# Altium project Temp_hum_sensor_Atmega328.PrjPcb
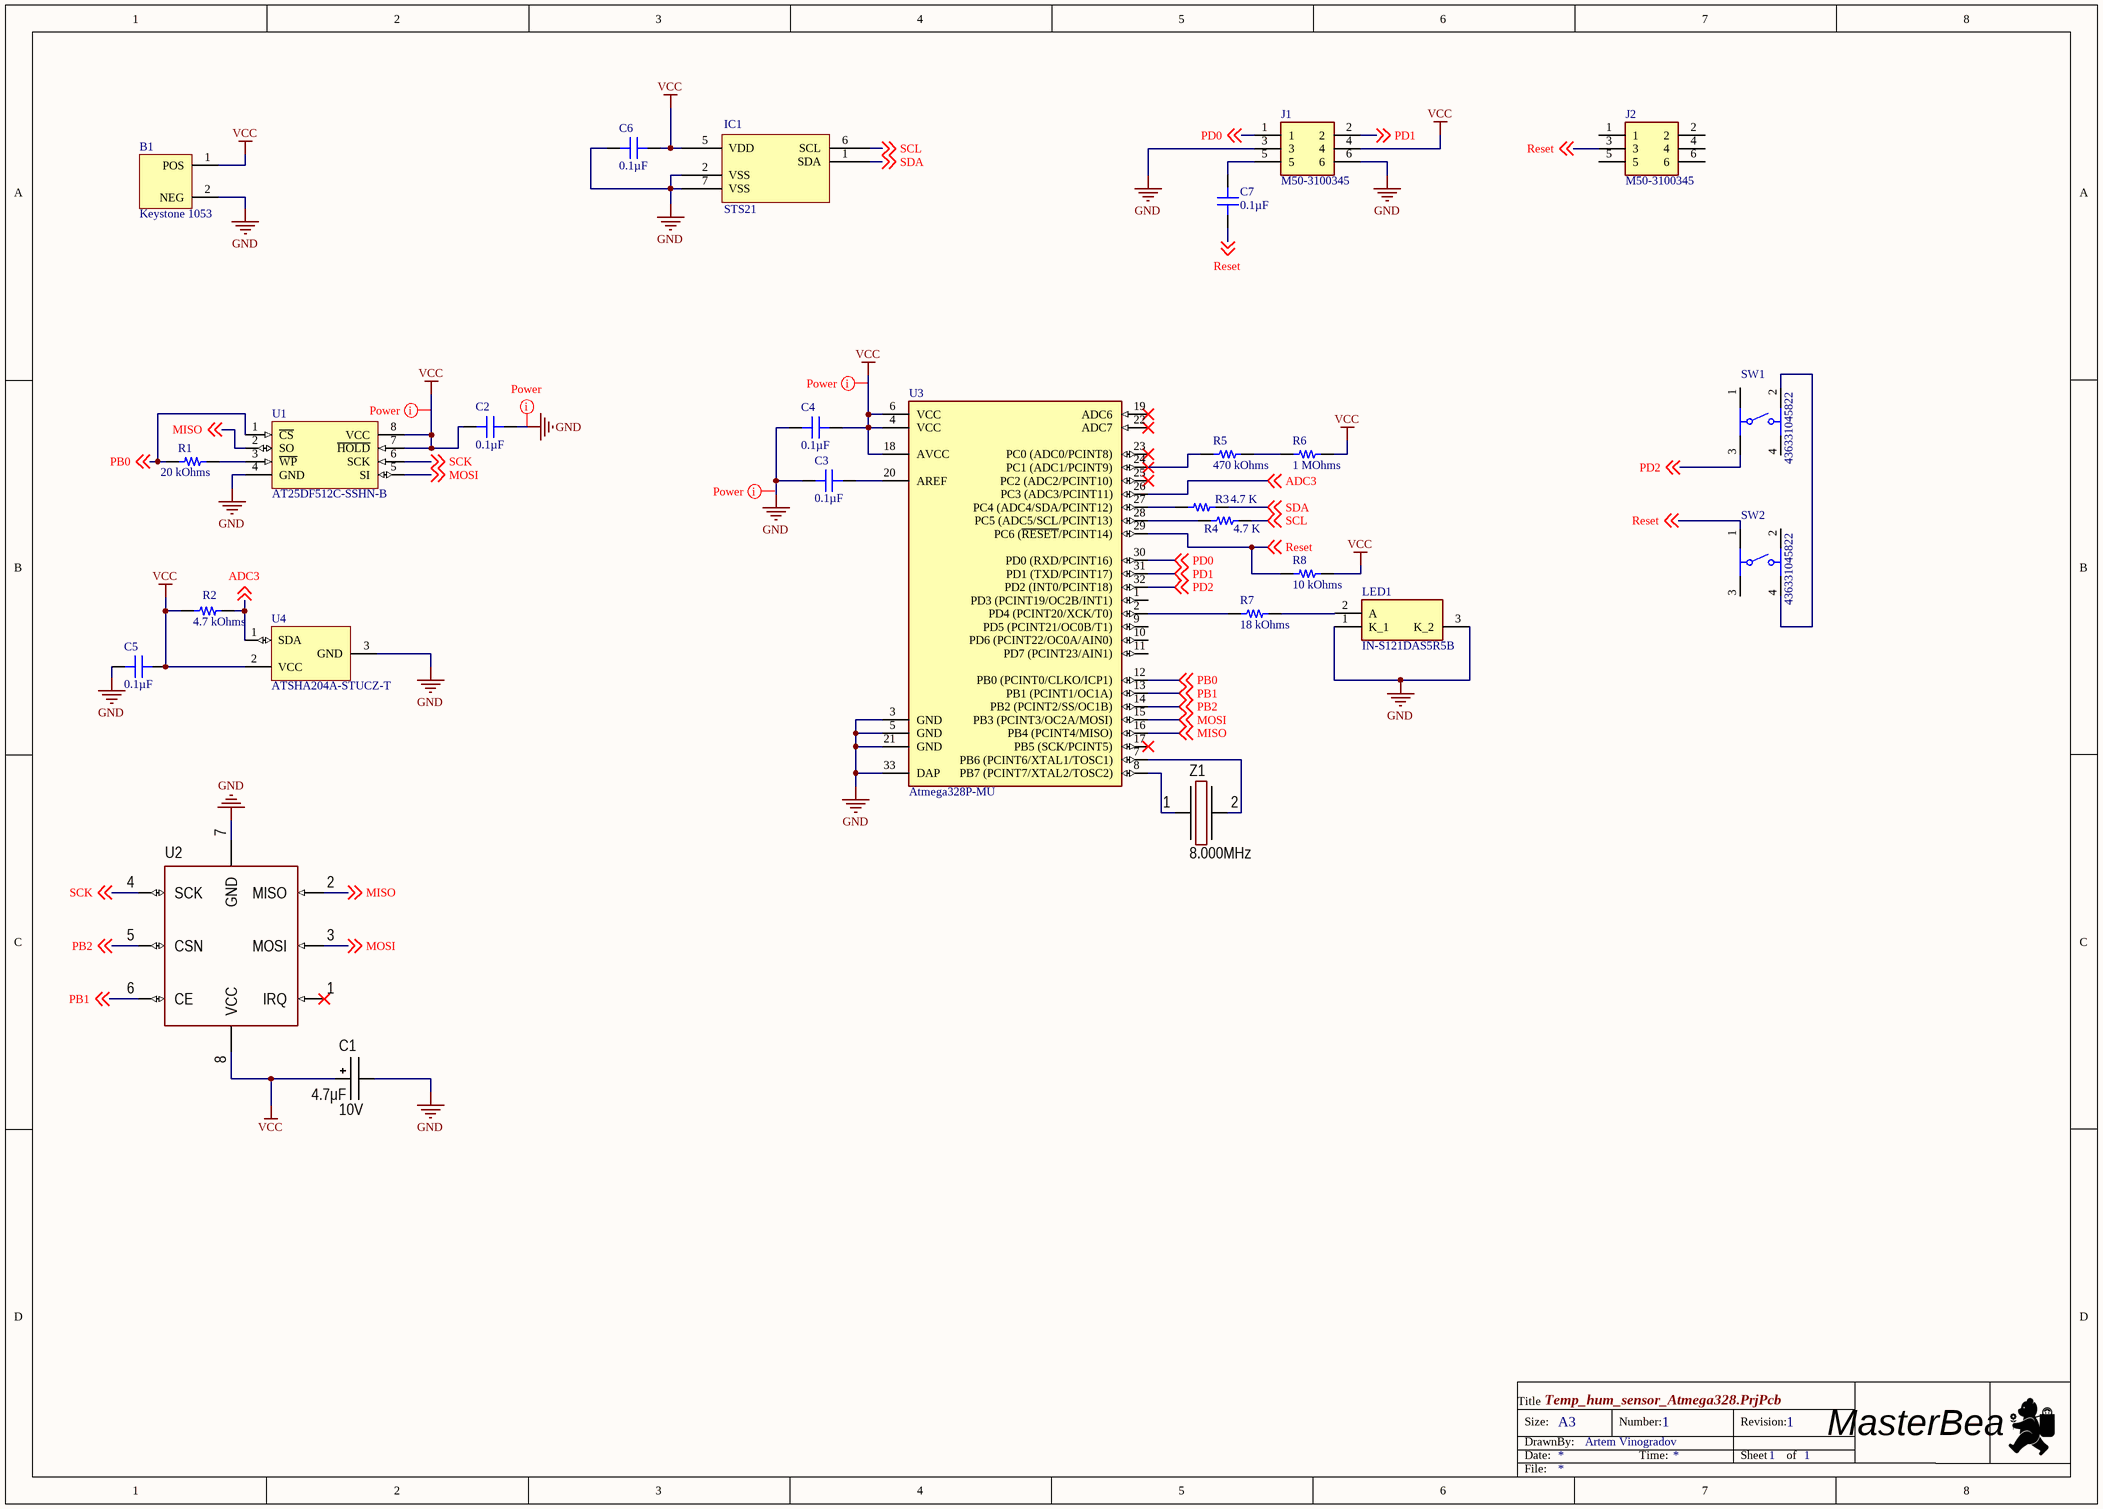
[diagram p0: Temp_hum_sensor_Atmega328.SchDoc]
Title: =title
1 sheet, 27 parts. Net scope: global (net labels, ports and power ports of the same name join across sheets).
Board file: Temp_hum_sensor_Atmega328.PcbDoc

## Sheet Temp_hum_sensor_Atmega328.SchDoc: =title
size A3; CompanyName: MasterBear; DrawnBy: Artem Vinogradov; DocumentNumber: 1; Revision: 1; SheetNumber: 1; SheetTotal: 1

### Parts
B1  Keystone 1053  [KEYSTONE 1053]
C1  value 4.7μF  Voltage: 10V  [CAP: TANTAL-A]
C2  0.1µF  [CAP 0805_2012]
C3  0.1µF  [CAP 0805_2012]
C4  0.1µF  [CAP 0805_2012]
C5  0.1µF  [CAP 0805_2012]
C6  0.1µF  [CAP 0805_2012]
C7  0.1µF  [CAP 0805_2012]
IC1  STS21  [SENSIRION STS21]
J1  M50-3100345  [M503100345]
J2  M50-3100345  [M503100345]
LED1  IN-S121DAS5R5B  [INS126ASUW]
R1  20 kOhms  [RES 0805_2012]
R2  4.7 kOhms  [RES 0805_2012]
R3  4.7 K  [RES 0805_2012]
R4  4.7 K  [RES 0805_2012]
R5  470 kOhms  [RES 0805_2012]
R6  1 MOhms  [RES 0805_2012]
R7  18 kOhms  [RES 0805_2012]
R8  10 kOhms  [RES 0805_2012]
SW1  436331045822  [4363x10458xx]
SW2  436331045822  [4363x10458xx]
U1  AT25DF512C-SSHN-B  [SOIC127P600X175-8N]
U2  (no value)  [MOD: NRF24 Mini SMD]
U3  Atmega328P-MU  [QFN-32 (5X5)]
U4  ATSHA204A-STUCZ-T  [SOT23-3]
Z1  Frequency: 8.000MHz  [OSC: 3215]

### Nets
GND: B1.2(NEG) C1.2 C2.2 C3.1 C4.1 C5.1 C6.1 IC1.2(VSS) IC1.7(VSS) J1.3 J1.6 LED1.1(K_1) LED1.3(K_2) U1.4(GND) U2.7(GND) U3.3(GND) U3.5(GND) U3.21(GND) U3.33(DAP) U4.3(GND)
VCC: B1.1(POS) C1.1 C2.1 C4.2 C5.2 C6.2 IC1.5(VDD) J1.4 R2.1 R6.2 R8.2 U1.7(~{HOLD}) U1.8(VCC) U2.8(VCC) U3.4(VCC) U3.6(VCC) U3.18(AVCC) U4.2(VCC)
ADC3: R2.2 U3.26(PC3_(ADC3/PCINT11)) U4.1(SDA) ; off-sheet ADC3
MISO: U1.2(SO) U2.2(MISO) U3.16(PB4_(PCINT4/MISO)) ; off-sheet MISO
MOSI: U1.5(SI) U2.3(MOSI) U3.15(PB3_(PCINT3/OC2A/MOSI)) ; off-sheet MOSI
PB0: R1.1 U1.1(~{CS}) U3.12(PB0_(PCINT0/CLKO/ICP1)) ; off-sheet PB0
PB1: U2.6(CE) U3.13(PB1_(PCINT1/OC1A)) ; off-sheet PB1
PB2: U2.5(CSN) U3.14(PB2_(PCINT2/SS/OC1B)) ; off-sheet PB2
PD0: J1.1 U3.30(PD0_(RXD/PCINT16)) ; off-sheet PD0
PD1: J1.2 U3.31(PD1_(TXD/PCINT17)) ; off-sheet PD1
PD2: SW1.3 U3.32(PD2_(INT0/PCINT18)) ; off-sheet PD2
Reset: C7.1 J2.3 R8.1 SW2.1 U3.29(PC6_(~{RESET}/PCINT14)) ; off-sheet Reset
SCK: U1.6(SCK) U2.4(SCK) ; off-sheet SCK
SCL: IC1.6(SCL) R4.2 ; off-sheet SCL
SDA: IC1.1(SDA) R3.2 ; off-sheet SDA
NetC3_2: C3.2 U3.20(AREF)
NetC7_2: C7.2 J1.5
NetLED1_2: LED1.2(A) R7.2
NetR1_2: R1.2 U1.3(~{WP})
NetR3_1: R3.1 U3.27(PC4_(ADC4/SDA/PCINT12))
NetR4_1: R4.1 U3.28(PC5_(ADC5/SCL/PCINT13))
NetR5_1: R5.1 U3.24(PC1_(ADC1/PCINT9))
NetR5_2: R5.2 R6.1
NetR7_1: R7.1 U3.2(PD4_(PCINT20/XCK/T0))
NetSW1_2: SW1.2 SW2.4
NetU3_7: U3.7(PB6_(PCINT6/XTAL1/TOSC1)) Z1.2
NetU3_8: U3.8(PB7_(PCINT7/XTAL2/TOSC2)) Z1.1

Not connected (* = marked no-connect by the designer): J2 1 2 4 5 6; SW1 1 4; SW2 2 3; U2 1(IRQ)*; U3 1(PD3_(PCINT19/OC2B/INT1)) 9(PD5_(PCINT21/OC0B/T1)) 10(PD6_(PCINT22/OC0A/AIN0)) 11(PD7_(PCINT23/AIN1)) 17(PB5_(SCK/PCINT5))* 19(ADC6)* 22(ADC7)* 23(PC0_(ADC0/PCINT8))* 25(PC2_(ADC2/PCINT10))*

### Layout directives
net class Power: (no net found under the mark), GND, VCC

### Notes on the sheet
- Title
- Size:
- Date:
- DrawnBy:
- A3
- Number:
- Time:
- Revision:
- Sheet
- of
- File:

### Library data of the parts
C1 = Tantal_A: Manufacturer: AVX; PartNumber: F930J107KAAAJ6; ValueManufacturerPartNumber: Tantalum capacitor, 4.7μF, 10V, ±10%, 2Ohm, case A (3216), -55...+125°C; Impedance: 2Ohm; Tolerance: ±10%; TypeDielectric: X7R; TypeCapacitor: Tantalum capacitor; Package: case A (3216); HelpURL: https://www.digikey.com/product-detail/en/avx-corporation/F930J107KAAAJ6/478-12404-1-ND/9645231; Temperature: -55...+125°C
C2-C7 = AC0805KKX8R9BB104: CAP CER 0805 10% X8R 50V 100NF; Manufacturer: Yageo; Part Number: AC0805KKX8R9BB104; Value: 0.1µF; Applications: Automotive; Capacitance: 0.1µF; ComponentLink1Description: Datasheet; ComponentLink1URL: http://www.yageo.com/documents/recent/AC0805KKX8R9BB104.pdf; ComponentLink2Description: DigiKey Link; ComponentLink2URL: http://digikey.com/product-detail/en/yageo/AC0805KKX8R9BB104/311-4624-1-ND/9699550; Device Package: 0805 (2012 Metric); LastUpdated: 21/01/2020 0.02.48; Lifecycle Status: Active; Minimum Order: 1; Mounting Type: Surface Mount, MLCC; Operating Temperature: -55°C ~ 150°C; Package / Case: 0805 (2012 Metric); Packaging: TapeAndReel; PartId: 14076; Part Status: Active; Price: 0.06; Ratings: AEC-Q200; Series: AC; Size / Dimension: 0.079" L x 0.049" W (2.00mm x 1.25mm); Supplier 1: DigiKey; Supplier Part Number 1: 311-4624-1-ND; Temperature Coefficient: X8R; Thickness (Max): 0.057" (1.45mm); Tolerance: ±10%; Voltage - Rated: 50V
IC1 = STS21: SENSOR DIGITAL -40C-125C 6DFN; Manufacturer: Sensirion AG; Accuracy - Highest (Lowest): ±0.2°C; Output Type: I²C; Resolution: 14 b; Sensing Temperature - Local: -40°C ~ 125°C; Sensor Type: Digital, Local; Test Condition: 25°C; Voltage - Supply: 2.1V ~ 3.6V; ComponentLink1Description: Datasheet; ComponentLink1URL: https://www.sensirion.com/file/datasheet_sts21; ComponentLink2Description: DigiKey Link; ComponentLink2URL: http://digikey.com/product-detail/en/sensirion-ag/STS21/1649-1016-1-ND/5872298; Device Package: 6-TDFN Exposed Pad; Features: Sleep Mode; LastUpdated: 20/04/2020 15.29.15; Lifecycle Status: Active; Part Number: STS21; Minimum Order: 1; Mounting Type: Surface Mount; Operating Temperature: -40°C ~ 125°C; Package / Case: 6-TDFN Exposed Pad; Packaging: TapeAndReel; Part Status: Active; Price: 1.70; Series: Automotive, AEC-Q100; Supplier 1: DigiKey; Supplier Part Number 1: 1649-1016-1-ND; Supplier Device Package: 6-DFN (3x3)
J1 J2 = M50-3100345: Connector; Manufacturer_Name: HARWIN; Datasheet Link: https://componentsearchengine.com/Datasheets/1/M50-3100345.pdf; Height: 4.85mm; Manufacturer_Part_Number: M50-3100345; Mouser Part Number: 855-M50-3100345; Mouser Price/Stock: https://www.mouser.co.uk/ProductDetail/Harwin/M50-3100345?qs=Jph8NoUxIfX8khz59iyZ%2FA%3D%3D; Supplier 1: Mouser; Supplier Part Number 1: 855-M50-3100345
LED1 = IN-S121DAS5R5B: LED; Manufacturer_Name: Inolux; Datasheet Link: http://www.inolux-corp.com/datasheet/SMDLED/Bi-Color%20Side%20View/IN-S121DAS5R5B%20v1.0.pdf; Height: 1mm; Manufacturer_Part_Number: IN-S121DAS5R5B; Arrow Part Number: IN-S121DAS5R5B; Arrow Price/Stock: https://www.arrow.com/en/products/in-s121das5r5b/inolux-corporation; Mouser Part Number: 743-IN-S121DAS5R5B; Mouser Price/Stock: https://www.mouser.com/Search/Refine.aspx?Keyword=743-IN-S121DAS5R5B
R1 = RQ73C2A20KBTD: RES 20 KOHMS 0.1% 1/5W 0805; Manufacturer: TE Connectivity Passive Product; Power (Watts): 0.2W, 1/5W; Temperature Coefficient: ±10ppm/°C; Part Number: RQ73C2A20KBTD; Value: 20 kOhms; ComponentLink1Description: Datasheet; ComponentLink1URL: //media.digikey.com/pdf/Data%20Sheets/Tyco%20Electronics%20P%20B%20PDFs/RQ73-0618%20v2.pdf; ComponentLink2Description: DigiKey Link; ComponentLink2URL: http://digikey.com/product-detail/en/te-connectivity-passive-product/RQ73C2A20KBTD/A139703CT-ND/9481190; Composition: Thin Film; Device Package: 0805 (2012 Metric); Features: Anti-Sulfur, Automotive AEC-Q200; Height - Seated (Max): 0.026" (0.65mm); LastUpdated: 21/01/2020 1.48.51; Lifecycle Status: Active; Minimum Order: 1; Number of Terminations: 2; Operating Temperature: -55°C ~ 155°C; Package / Case: 0805 (2012 Metric); Packaging: TapeAndReel; PartId: 30516; Part Status: Active; Price: 0.24; Ratings: AEC-Q200; Resistance: 20 kOhms; Series: RQ73; Size / Dimension: 0.079" L x 0.049" W (2.00mm x 1.25mm); Supplier 1: DigiKey; Supplier Part Number 1: A139703CT-ND; Supplier Device Package: 0805; Tolerance: ±0.1%
R2 = RTAN0805BKE4K70: RES 4.7K OHM 0.1% 1/5W 0805; Manufacturer: Stackpole Electronics Inc; Power (Watts): 0.2W, 1/5W; Temperature Coefficient: ±25ppm/°C; Part Number: RTAN0805BKE4K70; Value: 4.7 kOhms; ComponentLink1Description: Datasheet; ComponentLink1URL: https://www.seielect.com/catalog/sei-rtan.pdf; ComponentLink2Description: DigiKey Link; ComponentLink2URL: http://digikey.com/product-detail/en/stackpole-electronics-inc/RTAN0805BKE4K70/RTAN0805BKE4K70CT-ND/6602268; Composition: Thin Film; Device Package: 0805 (2012 Metric); Features: Anti-Sulfur, Automotive AEC-Q200, Moisture Resistant; Height - Seated (Max): 0.026" (0.65mm); LastUpdated: 21/01/2020 1.48.16; Lifecycle Status: Active; Minimum Order: 1; Number of Terminations: 2; Operating Temperature: -55°C ~ 155°C; Package / Case: 0805 (2012 Metric); Packaging: TapeAndReel; PartId: 31929; Part Status: Active; Price: 0.17; Ratings: AEC-Q200; Resistance: 4.7 kOhms; Series: RTAN; Size / Dimension: 0.079" L x 0.049" W (2.00mm x 1.25mm); Supplier 1: DigiKey; Supplier Part Number 1: RTAN0805BKE4K70CT-ND; Supplier Device Package: 0805; Tolerance: ±0.1%
R3 R4 = RTAN0805BKE4K70: RES 4.7K OHM 0.1% 1/5W 0805; Manufacturer: Stackpole Electronics Inc; Power (Watts): 0.2W, 1/5W; Resistance: 4.7 kOhms; Temperature Coefficient: ±25ppm/°C; Part Number: RTAN0805BKE4K70; Value: 4.7 K; ComponentLink1Description: Datasheet; ComponentLink1URL: https://www.seielect.com/catalog/sei-rtan.pdf; ComponentLink2Description: DigiKey Link; ComponentLink2URL: http://digikey.com/product-detail/en/stackpole-electronics-inc/RTAN0805BKE4K70/RTAN0805BKE4K70CT-ND/6602268; Composition: Thin Film; Device Package: 0805 (2012 Metric); Features: Anti-Sulfur, Automotive AEC-Q200, Moisture Resistant; Height - Seated (Max): 0.026" (0.65mm); LastUpdated: 21/01/2020 1.48.16; Lifecycle Status: Active; Minimum Order: 1; Number of Terminations: 2; Operating Temperature: -55°C ~ 155°C; Package / Case: 0805 (2012 Metric); Packaging: TapeAndReel; PartId: 31929; Part Status: Active; Price: 0.17; Ratings: AEC-Q200; Series: RTAN; Size / Dimension: 0.079" L x 0.049" W (2.00mm x 1.25mm); Supplier 1: DigiKey; Supplier Part Number 1: RTAN0805BKE4K70CT-ND; Supplier Device Package: 0805; Tolerance: ±0.1%
R5 = CRGP0805F470K: CRGP 0805 470K 1%; Manufacturer: TE Connectivity Passive Product; Power (Watts): 0.333W, 1/3W; Temperature Coefficient: ±100ppm/°C; Part Number: CRGP0805F470K; Value: 470 kOhms; ComponentLink1Description: Datasheet; ComponentLink1URL: https://www.te.com/commerce/DocumentDelivery/DDEController?Action=srchrtrv&DocNm=9-1773463-9&DocType=DS&DocLang=English; ComponentLink2Description: DigiKey Link; ComponentLink2URL: http://digikey.com/product-detail/en/te-connectivity-passive-product/CRGP0805F470K/A130509CT-ND/8578341; Composition: Thick Film; Device Package: 0805 (2012 Metric); Features: Pulse Withstanding; Height - Seated (Max): 0.026" (0.65mm); LastUpdated: 21.01.2020 1:49:38; Lifecycle Status: Active; Minimum Order: 1; Number of Terminations: 2; Operating Temperature: -55°C ~ 155°C; Package / Case: 0805 (2012 Metric); Packaging: TapeAndReel; PartId: 28755; Part Status: Active; Price: 0.02; Resistance: 470 kOhms; Series: CRGP; Size / Dimension: 0.079" L x 0.049" W (2.00mm x 1.25mm); Supplier 1: DigiKey; Supplier Part Number 1: A130509CT-ND; Supplier Device Package: 0805; Tolerance: ±1%
R6 = RCS08051M00FKEA: RES SMD 1M OHM 1% 0.4W 0805; Manufacturer: Vishay Dale; Power (Watts): 0.4W, 2/5W; Temperature Coefficient: ±100ppm/°C; Part Number: RCS08051M00FKEA; Value: 1 MOhms; ComponentLink1Description: Datasheet; ComponentLink1URL: http://www.vishay.com/docs/20065/rcse3.pdf; ComponentLink2Description: DigiKey Link; ComponentLink2URL: http://digikey.com/product-detail/en/vishay-dale/RCS08051M00FKEA/541-2853-1-ND/5867146; Composition: Thick Film; Device Package: 0805 (2012 Metric); Features: Automotive AEC-Q200, Pulse Withstanding; Height - Seated (Max): 0.020" (0.50mm); LastUpdated: 21.01.2020 1:50:02; Lifecycle Status: Active; Minimum Order: 1; Number of Terminations: 2; Operating Temperature: -55°C ~ 155°C; Package / Case: 0805 (2012 Metric); Packaging: TapeAndReel; PartId: 27791; Part Status: Active; Price: 0.03; Ratings: AEC-Q200; Resistance: 1 MOhms; Series: AccliMate™ RCU; Size / Dimension: 0.079" L x 0.049" W (2.00mm x 1.25mm); Supplier 1: DigiKey; Supplier Part Number 1: 541-2853-1-ND; Supplier Device Package: 0805; Tolerance: ±1%
R7 = CRGP0805F18K: CRGP 0805 18K 1%; Manufacturer: TE Connectivity Passive Product; Power (Watts): 0.333W, 1/3W; Temperature Coefficient: ±100ppm/°C; Part Number: CRGP0805F18K; Value: 18 kOhms; ComponentLink1Description: Datasheet; ComponentLink1URL: https://www.te.com/commerce/DocumentDelivery/DDEController?Action=srchrtrv&DocNm=9-1773463-9&DocType=DS&DocLang=English; ComponentLink2Description: DigiKey Link; ComponentLink2URL: http://digikey.com/product-detail/en/te-connectivity-passive-product/CRGP0805F18K/A130492CT-ND/8578324; Composition: Thick Film; Device Package: 0805 (2012 Metric); Features: Pulse Withstanding; Height - Seated (Max): 0.026" (0.65mm); LastUpdated: 21.01.2020 1:49:38; Lifecycle Status: Active; Minimum Order: 1; Number of Terminations: 2; Operating Temperature: -55°C ~ 155°C; Package / Case: 0805 (2012 Metric); Packaging: TapeAndReel; PartId: 28731; Part Status: Active; Price: 0.02; Resistance: 18 kOhms; Series: CRGP; Size / Dimension: 0.079" L x 0.049" W (2.00mm x 1.25mm); Supplier 1: DigiKey; Supplier Part Number 1: A130492CT-ND; Supplier Device Package: 0805; Tolerance: ±1%
R8 = RNCS0805BKE10K0: RES 10K OHM 0.1% 1/10W 0805; Manufacturer: Stackpole Electronics Inc; Power (Watts): 0.1W, 1/10W; Temperature Coefficient: ±25ppm/°C; Part Number: RNCS0805BKE10K0; Value: 10 kOhms; ComponentLink1Description: Datasheet; ComponentLink1URL: https://www.seielect.com/catalog/sei-rncs_rnch.pdf; ComponentLink2Description: DigiKey Link; ComponentLink2URL: http://digikey.com/product-detail/en/stackpole-electronics-inc/RNCS0805BKE10K0/RNCS0805BKE10K0CT-ND/1800164; Composition: Thin Film; Device Package: 0805 (2012 Metric); Features: Anti-Corrosive, Automotive AEC-Q200, Moisture Resistant; Height - Seated (Max): 0.026" (0.65mm); LastUpdated: 21.01.2020 1:50:08; Lifecycle Status: Active; Minimum Order: 1; Number of Terminations: 2; Operating Temperature: -55°C ~ 155°C; Package / Case: 0805 (2012 Metric); Packaging: TapeAndReel; PartId: 27713; Part Status: Active; Price: 0.09; Ratings: AEC-Q200; Resistance: 10 kOhms; Series: RNCS; Size / Dimension: 0.079" L x 0.049" W (2.00mm x 1.25mm); Supplier 1: DigiKey; Supplier Part Number 1: RNCS0805BKE10K0CT-ND; Supplier Device Package: 0805; Tolerance: ±0.1%
SW1 SW2 = 436331045822: WS-TASU SMT Tact Switch with Boss Design 4.7x3.5mm side push; Operation Force: 220gf; Rated Voltage: 12VDC; Rated Current: 50mA; Washable: No; ComponentLink1Description: Manufacturer; ComponentLink1URL: http://www.we-online.de; ComponentLink2Description: Datasheet; ComponentLink2URL: https://katalog.we-online.com/em/datasheet/436331045822.pdf; Operating Temperature: -40 to +85degC; Part Number: 436331045822; Published Date: September 2019; Contact Material: Stainless Steel; Height: 1.65mm; Mounting Technology: SMT; Contact Plating: Silver; Packaging: Tape and Reel; Terminal Material: Copper Alloy; Publisher: Wurth Elektronik; Terminal Plating: Silver
U2 = NRF24L01: Wi-Fi; Manufacturer: Espressif Systems; ValueManufacturerPartNumber: Wi-Fi module, 802.11 b/g/n, 32 bit, SDIO/SPI/UART, -40...+85°C, 21x16mm; Core: 32 bit; TypeInterface: SDIO/SPI/UART; TypeStandart: 802.11 b/g/n; HelpURL: https://www.chipdip.ru/product/esp-12e; Package: 21x16mm; ComponentType: Wi-Fi module; Temperature: -40...+85°C
Z1 = Crystal_3215: Manufacturer: Epson; PartNumber: FC-135 32.7680KA-A5; ValueManufacturerPartNumber: Crystal, 8.000MHz, 12.5pF, ±20ppm, case 3215, -40...+85°C; LoadCapacitance: 12.5pF; Tolerance: ±20ppm; Package: case 3215; HelpURL: https://www.digikey.com/product-detail/en/epson/FC-135-32.7680KA-A5/SER4103CT-ND/6188447; Temperature: -40...+85°C; TypeOscilator: Crystal
B1 = Keystone 1053: Supplier 1: Digi-Key; Supplier Part Number 1: 36-105-3-ND
U1 = AT25DF512C-SSHN-B: Supplier 1: Digi-Key; Supplier Part Number 1: 1265-1179-5-ND; Parameter 1: *
U3 = Atmega328P-MU: ComponentLink1Description: New link; ComponentLink1URL: *; Supplier 1: Digi-Key; Supplier Part Number 1: ATMEGA328P-MURCT-ND
U4 = ATSHA204A-STUCZ-T: Supplier 1: Farnell; Supplier Part Number 1: 2851689